# Altium schematic sheet Ports.SchDoc
size A4; DocumentNumber: 1; SheetNumber: 3; SheetTotal: 7
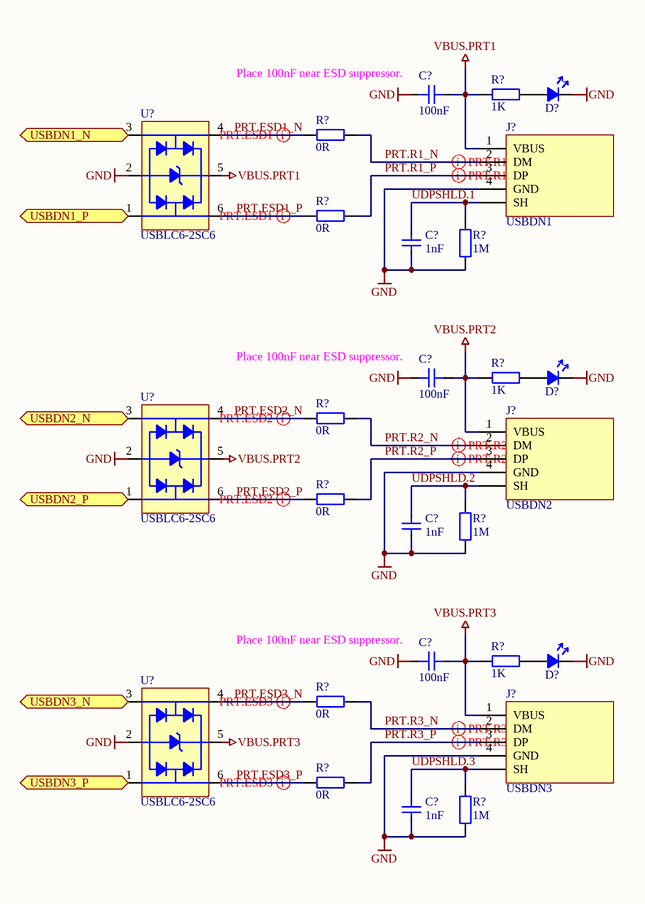
[diagram p0: Ports.SchDoc]

## Parts
(Parts that share a designator on the sheet are numbered #1, #2 ... from top to bottom, then left to right.)
C?#1  100nF  [0603C_RF_M]
C?#2  1nF  [0603C_RF_M]
C?#3  100nF  [0603C_RF_M]
C?#4  1nF  [0603C_RF_M]
C?#5  100nF  [0603C_RF_M]
C?#6  1nF  [0603C_RF_M]
D?#1  Unspecified  [0805LED_RF_M]  (value not drawn)
D?#2  Unspecified  [0805LED_RF_M]  (value not drawn)
D?#3  Unspecified  [0805LED_RF_M]  (value not drawn)
J?#1  USBDN1  [SAMTEC_USB-A-S-X-X-TH]
J?#2  USBDN2  [SAMTEC_USB-A-S-X-X-TH]
J?#3  USBDN3  [SAMTEC_USB-A-S-X-X-TH]
R?#1  1K  [0603R_RF_M]
R?#2  0R  [0603R_RF_M]
R?#3  0R  [0603R_RF_M]
R?#4  1M  [0603R_RF_M]
R?#5  1K  [0603R_RF_M]
R?#6  0R  [0603R_RF_M]
R?#7  0R  [0603R_RF_M]
R?#8  1M  [0603R_RF_M]
R?#9  1K  [0603R_RF_M]
R?#10  0R  [0603R_RF_M]
R?#11  0R  [0603R_RF_M]
R?#12  1M  [0603R_RF_M]
U?#1  USBLC6-2SC6  [TI_SOT-23-6]
U?#2  USBLC6-2SC6  [TI_SOT-23-6]
U?#3  USBLC6-2SC6  [TI_SOT-23-6]

## Ports
USBDN1_N (bidir), USBDN1_P (bidir), USBDN2_N (bidir), USBDN2_P (bidir), USBDN3_N (bidir), USBDN3_P (bidir)

## Nets
GND: C?#1.1 C?#2.1 C?#3.1 C?#4.1 C?#5.1 C?#6.1 D?#1.C D?#2.C D?#3.C J?#1.4(GND) J?#2.4(GND) J?#3.4(GND) R?#4.1 R?#8.1 R?#12.1 U?#1.2 U?#2.2 U?#3.2
VBUS.PRT1: C?#1.2 J?#1.1(VBUS) R?#1.1 U?#1.5
VBUS.PRT2: C?#3.2 J?#2.1(VBUS) R?#5.1 U?#2.5
VBUS.PRT3: C?#5.2 J?#3.1(VBUS) R?#9.1 U?#3.5
PRT.ESD1_N: R?#2.1 U?#1.4
PRT.ESD1_P: R?#3.1 U?#1.6
PRT.ESD2_N: R?#6.1 U?#2.4
PRT.ESD2_P: R?#7.1 U?#2.6
PRT.ESD3_N: R?#10.1 U?#3.4
PRT.ESD3_P: R?#11.1 U?#3.6
PRT.R1_N: J?#1.2(DM) R?#2.2
PRT.R1_P: J?#1.3(DP) R?#3.2
PRT.R2_N: J?#2.2(DM) R?#6.2
PRT.R2_P: J?#2.3(DP) R?#7.2
PRT.R3_N: J?#3.2(DM) R?#10.2
PRT.R3_P: J?#3.3(DP) R?#11.2
UDPSHLD.1: C?#2.2 J?#1.SH R?#4.2
UDPSHLD.2: C?#4.2 J?#2.SH R?#8.2
UDPSHLD.3: C?#6.2 J?#3.SH R?#12.2
USBDN1_N: U?#1.3 ; port USBDN1_N
USBDN1_P: U?#1.1 ; port USBDN1_P
USBDN2_N: U?#2.3 ; port USBDN2_N
USBDN2_P: U?#2.1 ; port USBDN2_P
USBDN3_N: U?#3.3 ; port USBDN3_N
USBDN3_P: U?#3.1 ; port USBDN3_P
NetD?#1_A: D?#1.A R?#1.2
NetD?#2_A: D?#2.A R?#5.2
NetD?#3_A: D?#3.A R?#9.2

## Layout directives
differential pair: PRT.ESD1_N, PRT.ESD1_P, PRT.ESD2_N, PRT.ESD2_P, PRT.ESD3_N, PRT.ESD3_P, PRT.R1_N, PRT.R1_P, PRT.R2_N, PRT.R2_P, PRT.R3_N, PRT.R3_P

## Notes on the sheet
- (near C?#1) Place 100nF near ESD suppressor.
- (near C?#3) Place 100nF near ESD suppressor.
- (near C?#5) Place 100nF near ESD suppressor.
- Author
- Date
- Revision
- Size
- A4
- Sheet
- of

## Library data of the parts
C?#1-C?#6 = C: Capacitor; Manufacturer: Generic Brand; Max Voltage: ? V; Tolerance: ?; Mounting Technology: SMT; Manufacturer Part No: *; Supplier: *; Supplier Link: http://; Supplier Part No: *; Category: Capacitor
  C?#1 C?#3 C?#5: Value: 100nF; Tag: *
  C?#2 C?#4 C?#6: Value: 1nF
D?#1-D?#3 = LED: Manufacturer: Generic Brand; Forward Voltage Drop: ? V; Emitting Color: Unspecified; Manufacturer Part No: *; Supplier: *; Supplier Link: http://; Supplier Part No: *; Category: Diode; Mounting Technology: SMT
J?#1-J?#3 = USB-A-S-S-W-TH: CONN RCPT USB2.0 TYPEA 4POS R/A; Manufacturer: Samtec Inc.; Supplier: DigiKey; Mounting Type: THT; Supplier Link: https://www.digikey.com/en/products/detail/samtec-inc/USB-A-S-S-W-TH/6679110; Supplier Part No: SAM10373-ND; Product Number: USB-A-S-S-W-TH
R?#1-R?#3 R?#5-R?#7 R?#9-R?#11 = R: Resistor; Manufacturer: Generic Brand; Power Rating: ? W; Max Voltage: ? V; Tolerance: ?; Supplier Link: http://; Category: Resistor; Mounting Technology: SMT
  R?#1 R?#5 R?#9: Value: 1K
  R?#2 R?#3 R?#6 R?#7 R?#10 R?#11: Value: 0R
R?#4 R?#8 R?#12 = R: Resistor; Manufacturer: Generic Brand; Max Voltage: ? V; Power Rating: ? W; Value: 1M; Tolerance: ?; Manufacturer Part No: *; Supplier: *; Supplier Link: http://; Supplier Part No: *; Category: Resistor; Mounting Technology: SMT
U?#1-U?#3 = USBLC6-2SC6: Low Capacitance USB ESD Protection; Manufacturer: STMicroelectronics; Supplier Link: https://www.chipdip.by/product/usblc6-2sc6; Supplier Part No: 9000039051; Supplier: Chipdip; Case: SOT-23-6; Mounting Type: SMT; Product Name: USBLC6-2SC6